# EAGLE design puente_h (EAGLE 7.3.0)
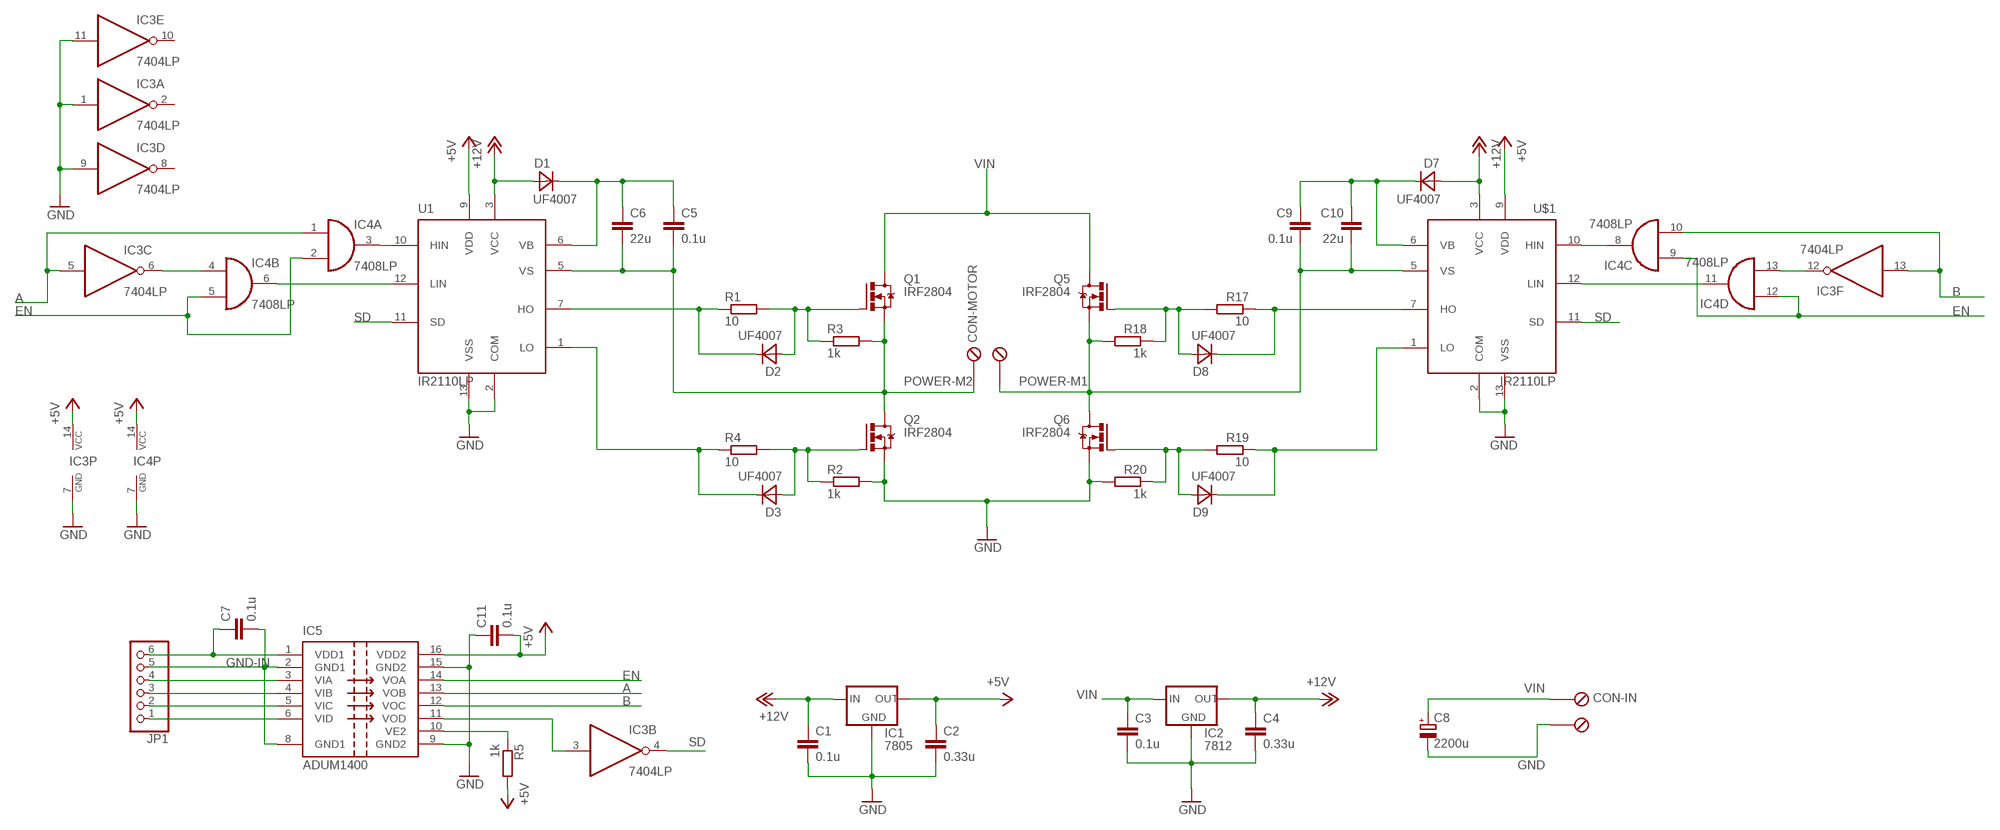
[diagram p0: schematic, sheet 1]

## Parts
C1  0.1u  C-EU050-025X075  [C050-025X075]
C2  0.33u  C-EU025-025X050  [C025-025X050]
C3  0.1u  C-EU050-025X075  [C050-025X075]
C4  0.33u  C-EU025-025X050  [C025-025X050]
C5  0.1u  C-EU050-025X075  [C050-025X075]
C6  22u  C-EU025-025X050  [C025-025X050]
C7  0.1u  C-EUC3216  [C3216]
C8  2200u  CPOL-EUE7.5-16  [E7,5-16]
C9  0.1u  C-EU050-025X075  [C050-025X075]
C10  22u  C-EU025-025X050  [C025-025X050]
C11  0.1u  C-EUC3216  [C3216]
CON-IN  METALTEX-2  [METALTEX-2]
CON-MOTOR  METALTEX-2  [METALTEX-2]
D1  UF4007  [UF4007]
D2  UF4007  [UF4007]
D3  UF4007  [UF4007]
D7  UF4007  [UF4007]
D8  UF4007  [UF4007]
D9  UF4007  [UF4007]
IC1  7805  78XXS  [78XXS]
IC2  7812  78XXS  [78XXS]
IC3  7404LP  [IR2110-LP]
IC4  7408LP  [IR2110-LP]
IC5  ADUM1400  [SO16W]
JP1  PINHD-1X6  [1X06]
Q1  IRF2804  [IRF2804]
Q2  IRF2804  [IRF2804]
Q5  IRF2804  [IRF2804]
Q6  IRF2804  [IRF2804]
R1  10  R-EU_0207/12  [0207/12]
R2  1k  R-EU_0207/12  [0207/12]
R3  1k  R-EU_0207/12  [0207/12]
R4  10  R-EU_0207/12  [0207/12]
R5  1k  R-EU_0207/12  [0207/12]
R17  10  R-EU_0207/12  [0207/12]
R18  1k  R-EU_0207/12  [0207/12]
R19  10  R-EU_0207/12  [0207/12]
R20  1k  R-EU_0207/12  [0207/12]
U1  IR2110LP  [IR2110-LP]
U$1  IR2110LP  [IR2110-LP]

## Nets
+5V: C2.1 C11.2 IC1.OUT IC3.14(P:VCC) IC4.14(P:VCC) IC5.16(VDD2) R5.2 U1.9(VDD) U$1.9(VDD)
+12V: C1.1 C4.1 D1.A D7.A IC1.IN IC2.OUT U1.3(VCC) U$1.3(VCC)
A: IC3.5(C:I) IC4.1(A:I0) IC5.13(VOB)
B: IC3.13(F:I) IC4.10(C:I1) IC5.12(VOC)
EN: IC4.2(A:I1) IC4.5(B:I1) IC4.9(C:I0) IC4.12(D:I0) IC5.14(VOA)
GND: C1.2 C2.2 C3.2 C4.2 C8.- C11.1 CON-IN.P2 IC1.GND IC2.GND IC3.1(A:I) IC3.7(P:GND) IC3.9(D:I) IC3.11(E:I) IC4.7(P:GND) IC5.9(GND2) IC5.15(GND2) Q2.S Q6.S R2.2 R20.2 U1.2(COM) U1.13(VSS) U$1.2(COM) U$1.13(VSS)
GND-IN: C7.2 IC5.2(GND1) IC5.8(GND1) JP1.5
N$1: C5.1 C6.1 D1.C U1.6(VB)
N$2: D2.C R1.1 U1.7(HO)
N$4: D2.A Q1.G R1.2 R3.1
N$6: D3.C R4.1 U1.1(LO)
N$7: D3.A Q2.G R2.1 R4.2
N$9: IC4.8(C:O) U$1.10(HIN)
N$10: IC3.6(C:O) IC4.4(B:I0)
N$11: IC4.3(A:O) U1.10(HIN)
N$12: IC4.6(B:O) U1.12(LIN)
N$15: IC5.5(VIC) JP1.2
N$16: IC5.10(VE2) R5.1
N$17: IC3.12(F:O) IC4.13(D:I1)
N$18: IC3.3(B:I) IC5.11(VOD)
N$19: IC4.11(D:O) U$1.12(LIN)
N$20: IC5.6(VID) JP1.1
N$21: IC5.4(VIB) JP1.3
N$22: IC5.3(VIA) JP1.4
N$24: C7.1 IC5.1(VDD1) JP1.6
N$30: C9.1 C10.1 D7.C U$1.6(VB)
N$32: D8.C R17.1 U$1.7(HO)
N$33: D8.A Q5.G R17.2 R18.1
N$35: D9.C R19.1 U$1.1(LO)
N$36: D9.A Q6.G R19.2 R20.1
POWER-M1: C9.2 C10.2 CON-MOTOR.P2 Q5.S Q6.D R18.2 U$1.5(VS)
POWER-M2: C5.2 C6.2 CON-MOTOR.P1 Q1.S Q2.D R3.2 U1.5(VS)
SD: IC3.4(B:O) U1.11(SD) U$1.11(SD)
VIN: C3.1 C8.+ CON-IN.P1 IC2.IN Q1.D Q5.D
Unconnected: IC3.2(A:O) IC3.8(D:O) IC3.10(E:O)

## Library data of the parts
C1-C7 C9-C11 = rcl:C-EU: CAPACITOR, European symbol
C8 = rcl:CPOL-EU: POLARIZED CAPACITOR, European symbol
CON-IN CON-MOTOR = components:METALTEX-2
D1-D3 D7-D9 = components:UF4007
IC1 IC2 = v-reg:78XXS: VOLTAGE REGULATOR
IC3 = components:74*04: Hex INVERTER
IC4 = components:74*08: Quad 2-input AND gate
IC5 = adum140x:ADUM1400
JP1 = pinhead:PINHD-1X6: PIN HEADER
Q1 Q2 Q5 Q6 = components:IRF2804
R1-R5 R17-R20 = rcl:R-EU_: RESISTOR, European symbol
U1 U$1 = components:IR2110: IR2110 High and low side driver.

## Board
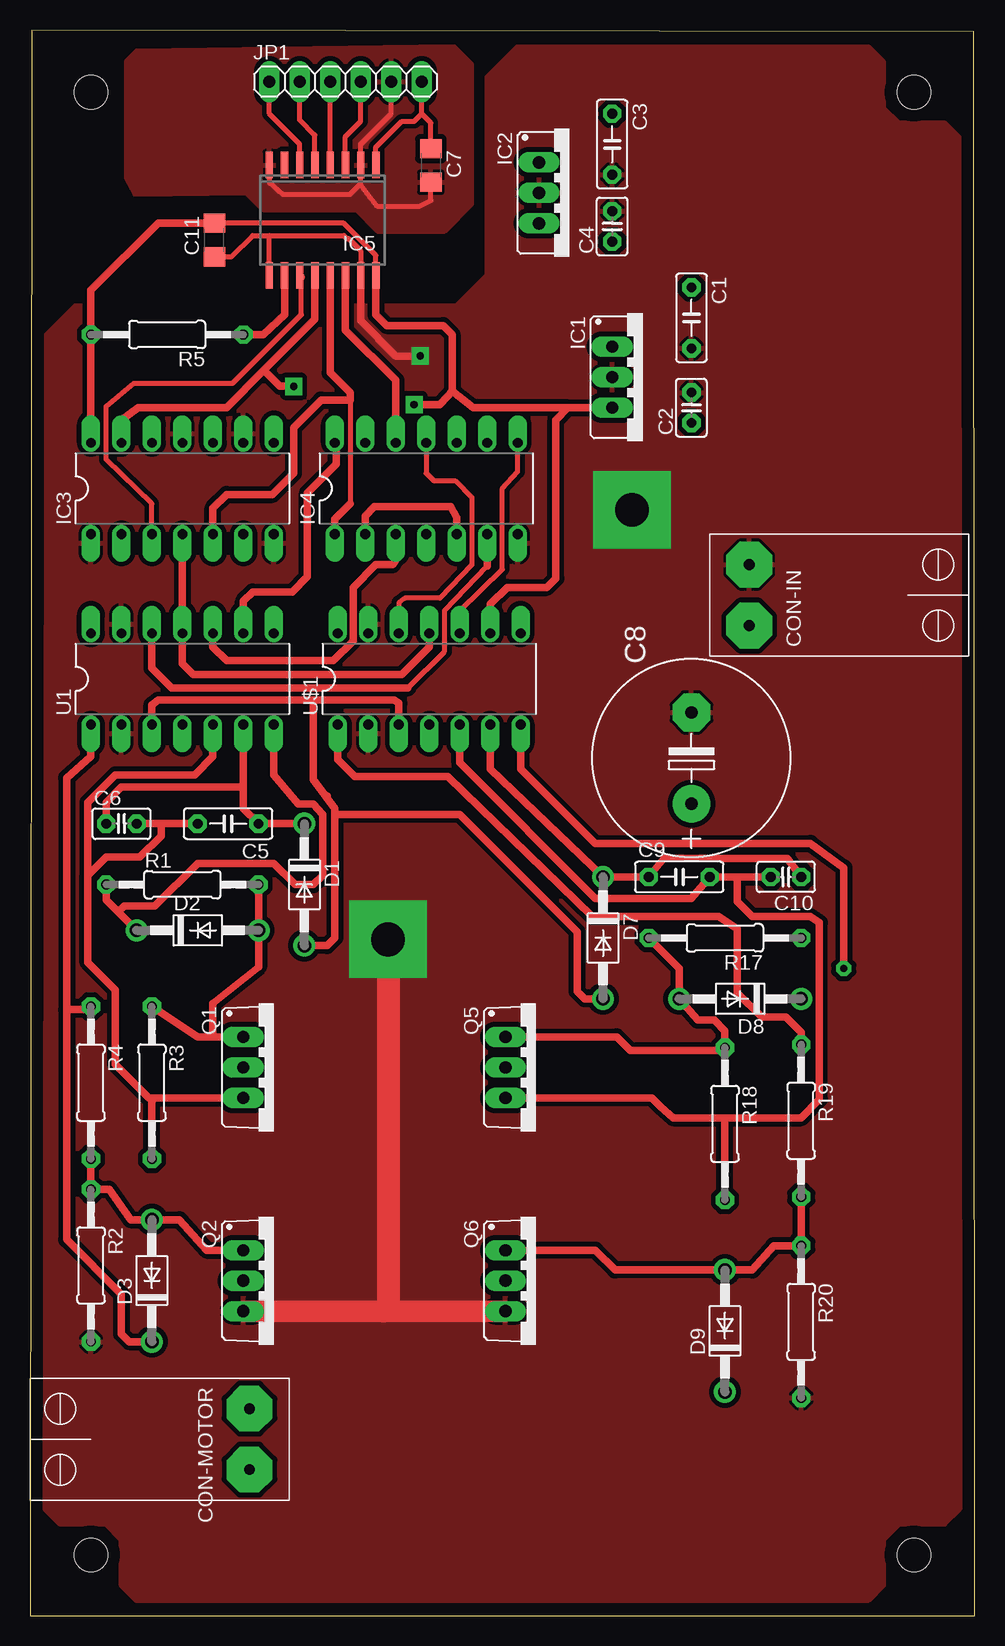
[diagram p1: board, top side]
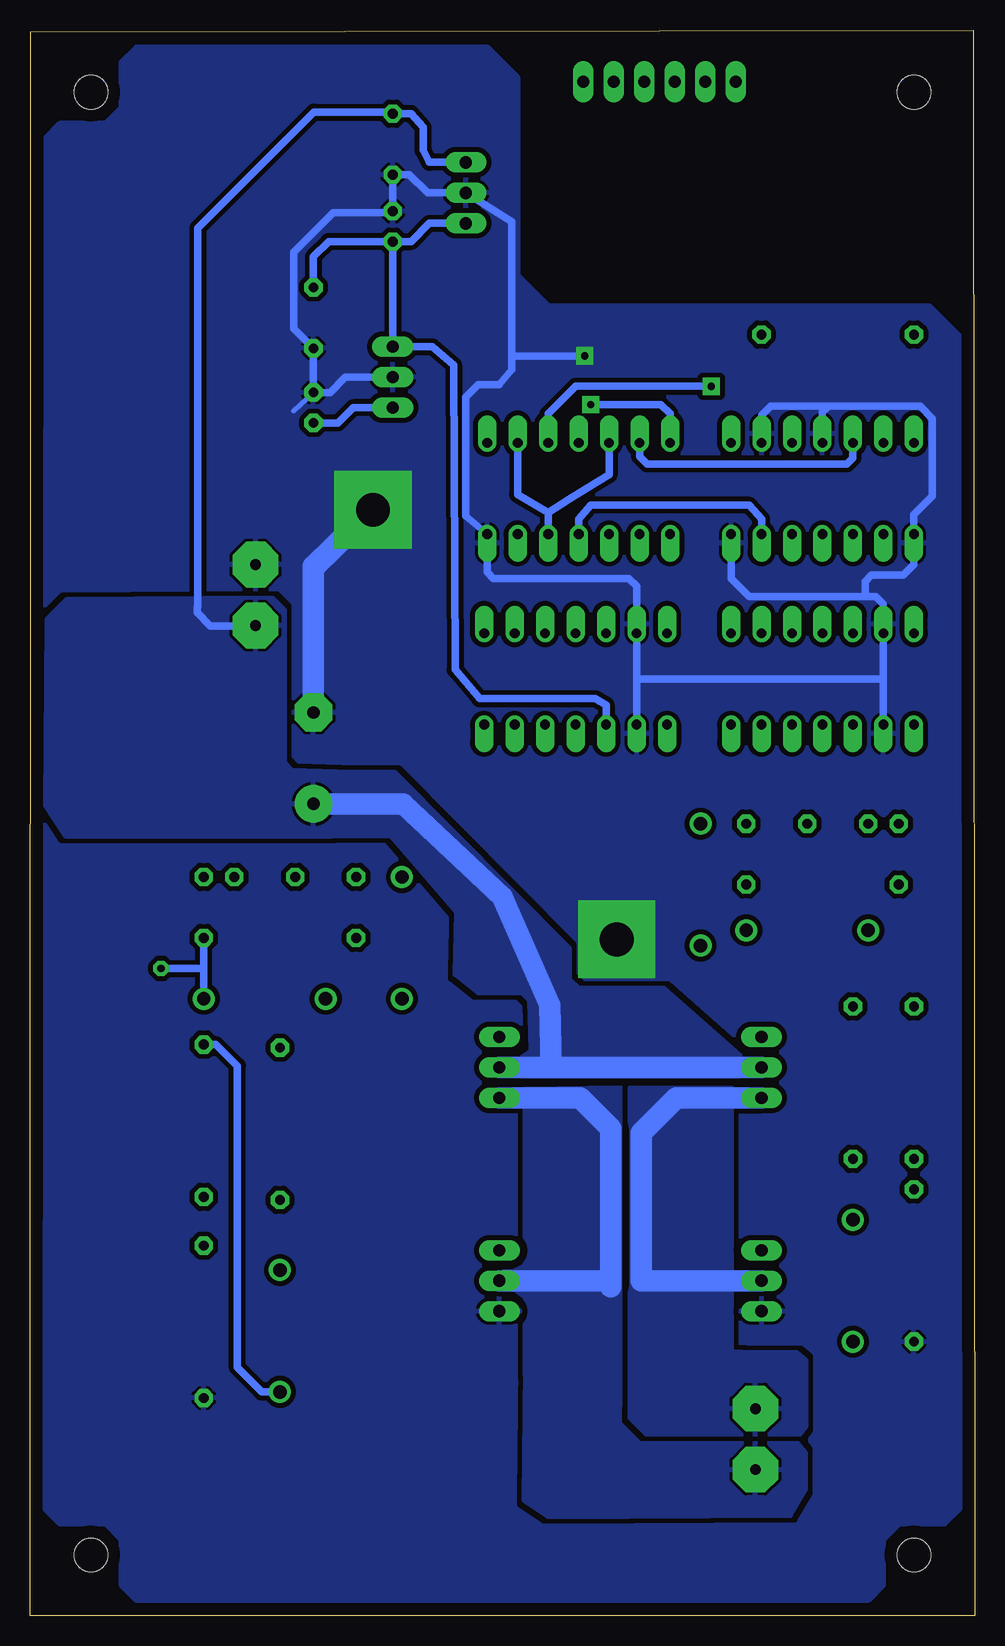
[diagram p2: board, bottom side, seen from below]

Size 78.74 x 132.2 mm. Coordinates in mm from the lower left corner, seen from the top.
Outline: 0,0 78.74,0 78.66,132.07 0.13,132.2 0,0
Copper layers (1*16): Top 0.035mm / dielectric 1.5mm / Bottom 0.035mm
Design rules "default *": minimum track width 10mil, minimum drill 24mil, track to track 8mil, track to pad 8mil, pad to pad 8mil, via to via 8mil, smd to smd 8mil, copper to edge 40mil, drill to drill 8mil, minimum pad ring 14mil, minimum via ring 8mil, stop-mask expansion 4mil, vias tented up to drill 0mil, thermal gap 10mil
Holes 2.8 mm at 5.08,127 73.66,127 73.66,5.08 5.08,5.08

### Footprints (pad centres in the part's own frame; a part is rotated, then mirrored left to right if it is on the bottom)
C050-025X075 = drill 0.813 octagon: 1 -2.54,0; 2 2.54,0
C025-025X050 = drill 0.813 octagon: 1 -1.27,0; 2 1.27,0
C3216 = smd 1.6 x 1.8: 1 -1.4,0; 2 1.4,0
E7,5-16 = drill 1.016 pad 3.15: + -3.81,0 | drill 1.016 pad 3.15 octagon: - 3.81,0
METALTEX-2 = drill 0.9 pad 3.81 octagon: P1 -2.54,1.778; P2 2.54,1.778
UF4007 = drill 1.118: A 6.35,0; C -3.81,0
78XXS = drill 1.016 long: GND 0,-2.54; IN -2.54,-2.54; OUT 2.54,-2.54
IR2110-LP = drill 0.813 offset: 1 -6.35,-3.81; 2 -3.81,-3.81; 3 -1.27,-3.81; 4 1.27,-3.81; 5 3.81,-3.81; 6 6.35,-3.81; 7 8.89,-3.81; 8 8.89,3.81; 9 6.35,3.81; 10 3.81,3.81; 11 1.27,3.81; 12 -1.27,3.81; 13 -3.81,3.81; 14 -6.35,3.81
SO16W = smd 0.6 x 2.2: 1 -4.445,-4.6; 2 -3.175,-4.6; 3 -1.905,-4.6; 4 -0.635,-4.6; 5 0.635,-4.6; 6 1.905,-4.6; 7 3.175,-4.6; 8 4.445,-4.6; 9 4.445,4.6; 10 3.175,4.6; 11 1.905,4.6; 12 0.635,4.6; 13 -0.635,4.6; 14 -1.905,4.6; 15 -3.175,4.6; 16 -4.445,4.6
1X06 = drill 1.016 long: 1 -6.35,0; 2 -3.81,0; 3 -1.27,0; 4 1.27,0; 5 3.81,0; 6 6.35,0
IRF2804 = drill 1.016 long: D 0,-2.54; G -2.54,-2.54; S 2.54,-2.54
0207/12 = drill 0.813 octagon: 1 -6.35,0; 2 6.35,0

### Placement (x,y rotation side)
C1  55.12,108.2 270 top
C2  55.12,100.71 90 top
C3  48.51,122.68 270 top
C4  48.51,115.82 90 top
C5  16.51,66.04 180 top
C6  7.62,66.04 0 top
C7  33.4,120.9 270 top
C8  55.12,71.5 90 top
C9  54.1,61.59 0 top
C10  62.99,61.59 180 top
C11  15.37,114.68 90 top
CON-IN  61.72,85.09 90 top
CON-MOTOR  16.51,14.73 270 top
D1  22.86,62.23 270 top
D2  12.7,57.15 0 top
D3  10.16,26.67 90 top
D7  47.75,57.78 270 top
D8  60.45,51.44 180 top
D9  57.91,22.48 90 top
IC1  51.05,103.25 270 top
IC2  44.96,118.62 270 top
IC3  11.43,93.98 0 top
IC4  31.75,93.98 0 top
IC5  24.38,116.33 180 top
JP1  26.29,127.89 0 top
Q1  20.32,45.72 270 top
Q2  20.32,27.94 270 top
Q5  42.16,45.72 270 top
Q6  42.16,27.94 270 top
R1  12.7,60.96 0 top
R2  5.08,29.21 270 top
R3  10.16,44.45 270 top
R4  5.08,44.45 270 top
R5  11.43,106.81 180 top
R17  57.91,56.52 180 top
R18  57.91,41.02 270 top
R19  64.26,41.27 270 top
R20  64.26,24.51 270 top
U1  11.43,78.1 0 top
U$1  32,78.1 0 top

### Tracks (layer width: path | path; a pad name or v marks a point on that pad's centre or on a via)
+5V  (via drill 0.6 pad 1.42)
  Top 0.406: IC5.16 28.83,113.41 26.16,116.08 C11.2
  Top 0.61: IC3.14 R5.2 5.08,110.49 10.67,116.08 14.73,116.08 14.86,115.95 15.24,115.95 C11.2 | 44.83,100.71 36.96,100.71 35.18,102.11 | U$1.9 38.35,84.33 39.75,85.72 43.05,85.72 43.81,86.49 43.81,99.69 44.83,100.71 | 35.18,102.11 34.29,101.09 34.16,100.97 v32,100.97 | IC5.16 28.83,108.46 29.72,107.57 34.42,107.57 35.18,106.81 35.18,102.11 | U1.9 17.78,84.58 18.54,85.34 21.84,85.34 23.11,86.61 23.11,93.6 25.53,96.01 25.53,97.66 IC4.14 | 44.83,100.71 IC1.OUT
  Bottom 0.61: IC1.OUT 51.82,100.71 53.09,99.44 C2.1 | IC4.14 25.4,100.2 26.16,100.97 v32,100.97
+12V
  Top 0.61: U$1.3 30.73,76.07 30.35,76.33 23.62,76.33 | 23.62,76.33 23.62,69.72 24.7,68.25 | 24.7,68.25 25.4,67.31 25.4,66.93 | 25.4,66.93 25.4,56.52 24.77,55.88 D1.A | 23.62,76.33 10.67,76.33 10.16,75.95 U1.3 | D7.A 46.23,51.44 45.59,52.07 45.59,57.02 35.81,66.8 25.53,66.8 25.4,66.93 | 24.78,68.33 24.7,68.25
  Bottom 0.61: C4.1 46.99,114.55 45.47,116.08 IC2.OUT | C4.1 IC1.IN 45.21,105.79 43.43,104.27 43.31,78.87 41.27,76.45 31.62,76.45 30.73,75.95 U$1.3 | C4.1 53.85,114.55 55.12,113.28 C1.1
A
  Top 0.406: 26.67,101.35 26.67,92.71
  Top 0.61: IC5.13 25.02,103.63 26.67,101.98 26.67,101.35 24.26,101.35 21.97,99.06 21.97,95.25 20.19,93.47 16.38,93.47 15.24,92.33 IC3.5 | IC4.1 25.4,91.44 26.67,92.71
B  (via drill 0.6 pad 1.42)
  Top 0.61: IC3.13 7.62,99.69 9.02,100.71 16.38,100.71 19.49,103.82 | 19.49,103.82 23.75,108.08 IC5.12 | v21.97,102.49 20.83,102.49 19.49,103.82
  Bottom 0.61: IC4.10 35.56,100.2 33.27,102.49 v21.97,102.49
EN
  Top 0.61: IC5.14 26.29,107.19 30.48,103 IC4.12 | IC4.2 27.94,91.69 28.7,92.46 35.05,92.46 35.56,91.57 IC4.5
  Bottom 0.61: IC4.9 38.1,93.47 35.56,91.95 | 35.56,91.95 IC4.5 | IC4.12 30.48,95.12 32.38,93.98 33.78,93.09 35.56,91.95
GND  (via drill 0.6 pad 1.42, 2.8 pad 6.45)
  Top 0.406: C11.1 16.76,113.28 18.54,115.06 19.94,115.06 | 19.94,115.06 26.16,115.06 26.42,114.81 26.54,114.81 27.56,113.79 IC5.15 | IC5.9 19.94,115.06
  Top 0.61: IC5.15 27.56,107.95 30.48,105.03 v32.51,105.03 | 27.81,25.4 27.81,25.53
  Top 1.778: Q2.S 27.81,25.4 29.46,25.4 Q6.S
  Top 1.93: v29.84,56.39 29.84,25.78 29.46,25.4
  Bottom 0.406: 56.77,100.46 C2.2 | 48.64,116.97 C4.2 | 38.48,105.03 38.61,104.9
  Bottom 0.61: C4.2 C3.2 47.12,120.14 45.59,118.62 IC2.GND 38.61,116.2 38.61,104.9 38.61,103.89 39.62,102.62 41.4,102.62 42.42,101.6 42.42,91.69 IC4.7 40.64,86.99 40.13,86.49 28.83,86.49 28.19,85.85 U$1.13 28.19,78.1 | IC1.GND 52.45,103.25 53.72,101.98 C2.2 C1.2 56.77,107.31 56.77,113.66 53.47,116.97 48.64,116.97 | 9.14,84.96 8.26,84.96 7.62,84.33 U1.13 7.62,78.1 | 9.14,84.96 18.8,84.96 20.32,86.49 IC3.7 | 28.19,78.1 U$1.2 | 7.62,78.1 U1.2 | v32.51,105.03 38.48,105.03 | 7.62,78.1 28.19,78.1 | 55.12,87.5 54.61,88.27 54.99,87.5 | 9.14,84.96 9.14,86.23 8.64,86.74 5.97,86.74 5.08,87.63 IC3.1 5.08,91.82 3.56,93.34 3.56,99.82 4.57,100.84 12.19,100.84 | IC3.11 12.7,100.33 12.19,100.84 | IC3.9 17.78,100.08 17.02,100.84 12.19,100.84
  Bottom 1.778: C8.- 55.12,87.5 54.99,87.5
  Bottom 1.93: 54.99,87.5 v50.16,92.2
  pour Top (isolate 0.61, rank 2): 30.73,53.21 33.02,53.21 33.15,53.21 37.21,49.15 37.21,26.04 20.57,26.04 20.57,48.39 25.4,53.21
  pour Bottom (isolate 0.406, rank 6): 1.27,106.68 1.27,8.89 2.54,7.62 6.35,7.62 7.62,6.35 7.62,2.54 8.89,1.27 69.85,1.27 71.12,2.54 71.12,6.35 72.39,7.62 76.2,7.62 77.47,8.89 77.47,123.19 76.2,124.46 72.39,124.46 71.12,125.73 71.12,129.54 69.85,130.81 40.64,130.81 38.1,128.27 38.1,111.76 35.56,109.22 3.81,109.22
  pour Top (isolate 0.406, rank 6): 1.27,106.68 3.81,109.22 35.56,109.22 38.1,111.76 38.1,128.27 40.64,130.81 69.85,130.81 71.12,129.54 71.12,125.73 72.39,124.46 76.2,124.46 77.47,123.19 77.47,8.89 76.2,7.62 72.39,7.62 71.12,6.35 71.12,2.54 69.85,1.27 8.89,1.27 7.62,2.54 7.62,6.35 6.35,7.62 2.54,7.62 1.27,8.89
GND-IN
  Top 0.406: JP1.5 30.1,125.22 27.56,122.68 IC5.2 27.56,119.38 | 27.56,119.38 27.56,119.25 28.96,117.47 32.38,117.47 33.4,117.98 C7.2 | IC5.8 19.94,119.51 21.08,118.49 26.67,118.49 27.56,119.38
  pour Top (isolate 0.406): 8,129.54 8,119.89 8.76,118.49 18.03,118.62 19.43,117.22 27.18,117.22 28.96,115.44 34.54,115.44 36.83,117.73 36.83,129.29 35.31,130.81 8.89,130.43
N$1
  Top 0.61: D1.C C5.1 17.78,67.31 17.78,69.09 | 17.78,69.09 U1.6 | C6.1 6.35,67.82 7.62,69.09 17.78,69.09
N$2
  Top 0.61: U1.7 20.32,70.1 22.35,67.69 23.62,67.69 24.38,66.8 24.38,61.72 23.62,60.96 22.1,60.96 20.32,62.74 13.97,62.74 10.41,59.18 7.87,59.18 7.37,58.67 | R1.1 6.35,59.69 7.37,58.67 | 7.37,58.67 D2.C
N$4
  Top 0.61: R1.2 D2.A 19.05,54.1 15.24,51.05 15.24,48.26 | Q1.G 15.24,48.26 | 15.24,48.26 13.97,48.26 R3.1
N$6
  Top 0.61: U1.1 5.08,71.63 3.05,69.85 3.05,50.55 | 3.05,50.55 3.05,31.37 7.62,26.8 7.62,23.5 8.26,22.86 D3.C | R4.1 4.83,50.55 3.05,50.55
N$7
  Top 0.61: Q2.G 14.73,30.48 12.45,33.02 D3.A 8.38,33.02 6.6,35.56 R2.1 R4.2
  Bottom 0.254: 5.26,37.82 R4.2
N$9
  Top 0.406: 35.81,83.82 39.37,87.25 39.37,93.98 40.64,95.38 IC4.8
  Top 0.61: U$1.10 35.81,83.82
N$10
  Bottom 0.61: IC3.6 17.78,91.44 18.8,92.58 32,92.58 33.02,91.44 IC4.4
N$11
  Top 0.61: U1.10 15.24,80.77 16.38,79.63 25.27,79.63 26.92,81.28 26.92,85.72 28.83,87.63 30.23,87.63 30.48,88.01 IC4.3
N$12
  Top 0.406: 38.1,87.5 34.54,83.82 34.54,80.39 31.5,77.34
  Top 0.61: U1.12 10.16,78.99 11.81,77.34 31.5,77.34 | 38.1,87.5 IC4.6
N$15
  Top 0.254: IC5.5 23.77,121.03 23.75,121.03
  Top 0.406: 23.75,120.9 IC5.5 23.75,121.03 23.75,123.44 22.48,124.71 JP1.2
N$16
  Top 0.61: R5.1 19.43,106.81 21.21,108.46 IC5.10
N$17
  Bottom 0.61: IC3.12 10.16,96.52 10.67,96.01 27.3,96.01 27.94,96.65 IC4.13
N$18
  Top 0.406: IC3.3 10.16,92.71 6.35,96.39 6.35,100.84 8.64,102.74 16.89,102.74 22.61,108.46 22.61,111.6
  Top 0.61: 22.61,111.6 IC5.11
N$19
  Top 0.406: IC4.11 33.02,95.25 33.66,94.61 35.43,94.61 36.83,93.22 36.83,87.63 34.16,84.84 31.24,84.84 30.73,84.45 U$1.12
N$20
  Top 0.254: IC5.6 22.63,121.03 22.48,121.03
  Top 0.406: 22.48,120.9 IC5.6 22.48,121.03 22.48,122.68 19.94,125.22 JP1.1
N$21
  Top 0.254: IC5.4 25.15,121.03 25.02,121.03
  Top 0.406: 25.02,120.9 IC5.4 25.02,121.03 JP1.3
N$22
  Top 0.406: 26.29,120.9 IC5.3 26.29,121.03 26.29,123.32 27.56,124.59 JP1.4
N$24
  Top 0.254: IC5.1 28.8,121.03 28.83,121.03
  Top 0.406: 28.83,120.9 IC5.1 28.83,121.03 28.83,122.43 30.99,124.59 32,124.59 32.64,125.22 | 32.64,125.22 JP1.6 | C7.1 33.4,124.46 32.64,125.22
N$30
  Top 0.61: U$1.6 38.35,70.61 46.86,62.48 D7.C C9.1 52.83,63.12 63.12,63.12 C10.1
N$32  (via drill 0.6 pad 1.27)
  Top 0.61: U$1.7 40.89,70.61 47.12,64.39 65.02,64.39 67.82,62.36 v67.82,53.97
  Bottom 0.61: v67.82,53.97 64.26,53.97 | 64.26,53.97 R17.1 | D8.C 64.26,53.97
N$33
  Top 0.61: R17.2 54.1,53.97 D8.A 55.63,49.66 57.02,49.66 57.91,48.77 R18.1 57.66,47.12 50.04,47.12 48.9,48.26 Q5.G
N$35
  Top 0.61: U$1.1 25.65,71.37 27.05,69.98 34.8,69.98 46.86,58.29 57.4,58.29 58.93,57.28 58.93,51.94 60.96,49.91 62.99,49.91 64.26,48.64 R19.1
  Bottom 0.61: D9.C 59.44,18.67 61.47,20.7 61.47,45.85 63.25,47.62 R19.1
N$36
  Top 0.61: R19.2 R20.1 61.98,30.86 60.2,28.83 D9.A 48.77,28.83 47.12,30.48 Q6.G
POWER-M1
  Top 0.61: 58.93,61.59 C9.2 55.12,59.82 47.12,59.82 35.81,71.12 U$1.5 | 58.93,61.59 C10.2 | 57.78,41.53 53.59,41.53 52.58,42.42 51.82,43.18 Q5.S | 57.78,41.53 64.26,41.53 65.79,43.05 65.79,57.78 65.02,58.29 60.2,58.29 58.93,59.56 58.93,61.59 | R18.2 57.91,41.4 57.78,41.53
  Bottom 0.61: 30.86,27.94 30.35,27.43
  Bottom 1.778: 30.35,27.43 30.35,40.64 32.89,43.18 Q5.S | Q6.D 30.86,27.94
  pour Bottom (isolate 0.61, rank 2, no thermals): 29.59,44.07 29.59,17.53 31.62,17.53 32.13,19.18 36.58,19.18 37.47,20.07 37.47,26.54 38.35,27.18 39.24,27.18 39.24,28.7 38.48,28.7 37.47,29.21 37.47,43.94
  pour Bottom (isolate 0.406): 14.73,14.35 27.94,14.35 29.59,16 29.59,20.57 37.47,20.57 37.59,9.65 35.56,8.26 15.37,8.38 14.1,10.54 14.1,13.59
POWER-M2
  Top 0.61: C5.2 10.92,66.04 | 10.92,66.04 C6.2 | 10.41,43.18 9.91,43.18 7.11,45.97 7.11,52.2 4.83,54.48 4.83,61.72 | 10.41,43.18 Q1.S | 4.83,61.72 6.35,63.25 9.14,63.25 10.92,65.02 10.92,66.04 | U1.5 15.24,71.63 13.72,70.1 7.11,70.1 4.83,67.82 4.83,61.72 | R3.2 10.16,42.93 10.41,43.18
  Bottom 1.778: Q1.S 24.89,43.18 27.81,40.26 27.81,27.94 Q2.D
  pour Bottom (isolate 0.61, rank 2): 20.32,44.07 20.32,19.3 28.7,19.3 28.7,44.07
  pour Bottom (isolate 0.406, rank 2): 14.1,15.75 14.73,14.99 27.69,15.11 28.7,16.13 28.7,21.84 28.45,22.1 14.86,21.97 14.1,21.34
SD
  Top 0.61: IC3.4 U1.11 12.7,79.38 13.59,78.49 30.99,78.49 33.27,80.77 U$1.11
VIN
  Bottom 0.61: IC2.IN 45.47,121.16 45.97,122.17 45.97,124.08 46.99,125.22 C3.1 48.64,125.35 55.09,125.35 64.75,115.7 64.75,84.15 64.82,84.07 64.82,83.64 63.7,82.52 59.97,82.52 CON-IN.P1
  Bottom 1.778: Q1.D 35.31,45.72 | 35.31,45.72 Q5.D | 35.31,45.72 35.43,50.93 39.37,59.94 47.62,67.69 C8.+
  pour Bottom: 55.12,70.36 48.39,70.36 33.78,55.63 33.78,53.09 33.02,52.32 25.91,52.32 19.56,46.74 18.92,46.1 18.92,45.47 19.43,44.96 38.23,44.96 38.61,45.34 38.61,46.1 37.34,46.86 36.96,47.12 37.08,51.31 37.72,51.94 41.4,51.94 43.31,53.47 43.18,58.67 48.64,65.02 53.85,65.02 55.12,66.04
  pour Bottom (isolate 0.61): 58.55,84.84 75.69,84.71 77.34,83.06 77.47,67.56 75.82,65.02 53.59,65.02 53.21,66.17 53.21,70.36 56.9,70.48 57.53,71.12 57.53,83.82